# EAGLE design gsm_based_message_display_on_lcd (EAGLE 6.1)
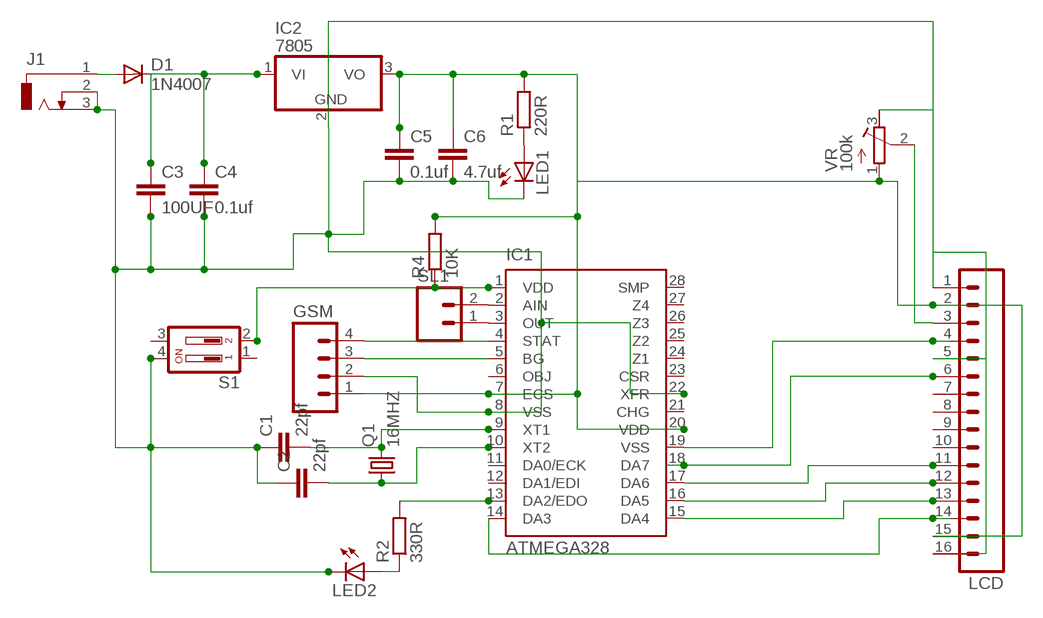
[diagram p0: schematic, sheet 1]

## Parts
C1  22pf  C2.5/2  [C2.5-2]
C2  22pf  C2.5/2  [C2.5-2]
C3  100UF  C2.5/2  [C2.5-2]
C4  0.1uf  C2.5/2  [C2.5-2]
C5  0.1uf  C2.5/2  [C2.5-2]
C6  4.7uf  C2.5/2  [C2.5-2]
D1  1N4007  1N4004  [DO41-10]
GSM  M04  [04P]
IC1  ATMEGA328  QT9701BD  [DIL28-3]
IC2  7805  786TV  [TO220V]
J1  DCJ0303  [DCJ0303]
LCD  M16  [16P]
LED1  LED3MM  [LED3MM]
LED2  LED3MM  [LED3MM]
Q1  16MHZ  CRYSTALHC49S  [HC49/S]
R1  220R  R-EU_0207/10  [0207/10]
R2  330R  R-EU_0207/10  [0207/10]
R4  10K  R-EU_0207/10  [0207/10]
S1  DP02  [DP-02]
SL1  M02  [02P]
VR  100k  R-TRIMM64P  [RTRIM64P]

## Nets
N$1: C1.2 IC1.9(XT1) Q1.2
N$2: C2.2 IC1.10(XT2) Q1.1
N$3: D1.A J1.1
N$4: C5.1 C6.1 GSM.1 IC1.7(ECS) IC1.20(VDD) IC2.3(VO) LCD.2 LCD.15 R1.2 R4.2 VR.1(E)
N$5: C1.1 C2.1 C3.2 C4.2 C5.2 C6.2 GSM.2 IC1.8(VSS) IC1.22(XFR) IC2.2(GND) J1.2 J1.3 LCD.1 LCD.5 LCD.16 LED1.K(C) LED2.K(C) S1.4 VR.3(A)
N$6: LED1.A R1.1
N$7: C3.1 C4.1 D1.C IC2.1(VI)
N$8: GSM.4 IC1.4(STAT)
N$9: GSM.3 IC1.5(BG)
N$10: IC1.3(OUT) SL1.1
N$11: IC1.2(AIN) SL1.2
N$21: IC1.13(DA2/EDO) R2.2
N$22: LCD.3 VR.2(S)
N$23: IC1.19(VSS) LCD.4
N$24: IC1.18(DA7) LCD.6
N$25: IC1.17(DA6) LCD.11
N$26: IC1.16(DA5) LCD.12
N$27: IC1.15(DA4) LCD.13
N$29: IC1.14(DA3) LCD.14
N$31: IC1.1(VDD) R4.1 S1.2
N$32: LED2.A R2.1
Unconnected: IC1.6(OBJ) IC1.11(DA0/ECK) IC1.12(DA1/EDI) IC1.21(CHG) IC1.23(CSR) IC1.24(Z1) IC1.25(Z2) IC1.26(Z3) IC1.27(Z4) IC1.28(SMP) LCD.7 LCD.8 LCD.9 LCD.10 S1.1 S1.3

## Library data of the parts
C1-C6 = capacitor-wima:C: CAPACITOR naming: grid - package width
D1 = diode:1N4004: DIODE general purpose rectifier, 1 A
GSM = con-amp-quick:M04: AMP QUICK CONNECTOR; OC_FARNELL: unknown; OC_NEWARK: unknown
IC1 = quantum-research-group:QT9701B: Charge-Transfer Capacitance Sensor IC Source: http://data.qprox.com/downloads/datasheets/qt9701b.pdf; OC_FARNELL: unknown; OC_NEWARK: unknown
IC2 = linear:78*: Positive VOLTAGE REGULATOR Source: http://cache.national.com/ds/LM/LM78L05.pdf http://www.fairchildsemi.com/ds/LM/LM7805.pdf
J1 = con-jack:DCJ0303: DC POWER JACK Source: DCJ0303.pdf; OC_FARNELL: unknown; OC_NEWARK: unknown
LCD = con-amp-quick:M16: AMP QUICK CONNECTOR; OC_FARNELL: unknown; OC_NEWARK: unknown
LED1 LED2 = led:LED: LED OSRAM: - CHIPLED LG R971, LG N971, LY N971, LG Q971, LY Q971, LO R971, LY R971 LH N974, LH R974 LS Q976, LO Q976, LY Q976 LO Q996 - Hyper CHIPLED LW Q18S LB Q993, LB Q99A, LB R99A - SideLED LS A670, LO A670, LY A670, LG A670, LP A670 LB A673, LV A673, LT A673, LW A673 LH A674 LY A675 LS A676, LA A676, LO A676, LY A676, LW A676 LS A679, LY A679, LG A679 - Hyper Micro SIDELED® LS Y876, LA Y876, LO Y876, LY Y876 LT Y87S - SmartLED LW L88C, LW L88S LB L89C, LB L89S, LG L890 LS L89K, LO L89K, LY L89K LS L896, LA L896, LO L896, LY L896 - TOPLED LS T670, LO T670, LY T670, LG T670, LP T670 LSG T670, LSP T670, LSY T670, LOP T670, LYG T670 LG T671, LOG T671, LSG T671 LB T673, LV T673, LT T673, LW T673 LH T674 LS T676, LA T676, LO T676, LY T676, LB T676, LH T676, LSB T676, LW T676 LB T67C, LV T67C, LT T67C, LS T67K, LO T67K, LY T67K, LW E67C LS E67B, LA E67B, LO E67B, LY E67B, LB E67C, LV E67C, LT E67C LW T67C LS T679, LY T679, LG T679 LS T770, LO T770, LY T770, LG T770, LP T770 LB T773, LV T773, LT T773, LW T773 LH T774 LS E675, LA E675, LY E675, LS T675 LS T776, LA T776, LO T776, LY T776, LB T776 LHGB T686 LT T68C, LB T68C - Hyper Mini TOPLED® LB M676 - Mini TOPLED Santana® LG M470 LS M47K, LO M47K, LY M47K Source: http://www.osram.convergy.de LUXEON: - LUMILED® LXK2-PW12-R00, LXK2-PW12-S00, LXK2-PW14-U00, LXK2-PW14-V00 LXK2-PM12-R00, LXK2-PM12-S00, LXK2-PM14-U00 LXK2-PE12-Q00, LXK2-PE12-R00, LXK2-PE12-S00, LXK2-PE14-T00, LXK2-PE14-U00 LXK2-PB12-K00, LXK2-PB12-L00, LXK2-PB12-M00, LXK2-PB14-N00, LXK2-PB14-P00, LXK2-PB14-Q00 LXK2-PR12-L00, LXK2-PR12-M00, LXK2-PR14-Q00, LXK2-PR14-R00 LXK2-PD12-Q00, LXK2-PD12-R00, LXK2-PD12-S00 LXK2-PH12-R00, LXK2-PH12-S00 LXK2-PL12-P00, LXK2-PL12-Q00, LXK2-PL12-R00 Source: www.luxeon.com KINGBRIGHT: KA-3528ASYC Source: www.kingbright.com
Q1 = crystal:CRYSTAL: CRYSTAL; OC_FARNELL: 1667008; OC_NEWARK: unknown
R1 R2 R4 = rcl:R-EU_: RESISTOR, European symbol
S1 = switch-dil:DP02: DIL/CODE SWITCH; MPN: MCDP02; OC_FARNELL: 1255233; OC_NEWARK: 26M1095
SL1 = con-amp-quick:M02: AMP QUICK CONNECTOR; OC_FARNELL: unknown; OC_NEWARK: unknown
VR = resistor:R-TRIMM: Trimm resistor

## Board
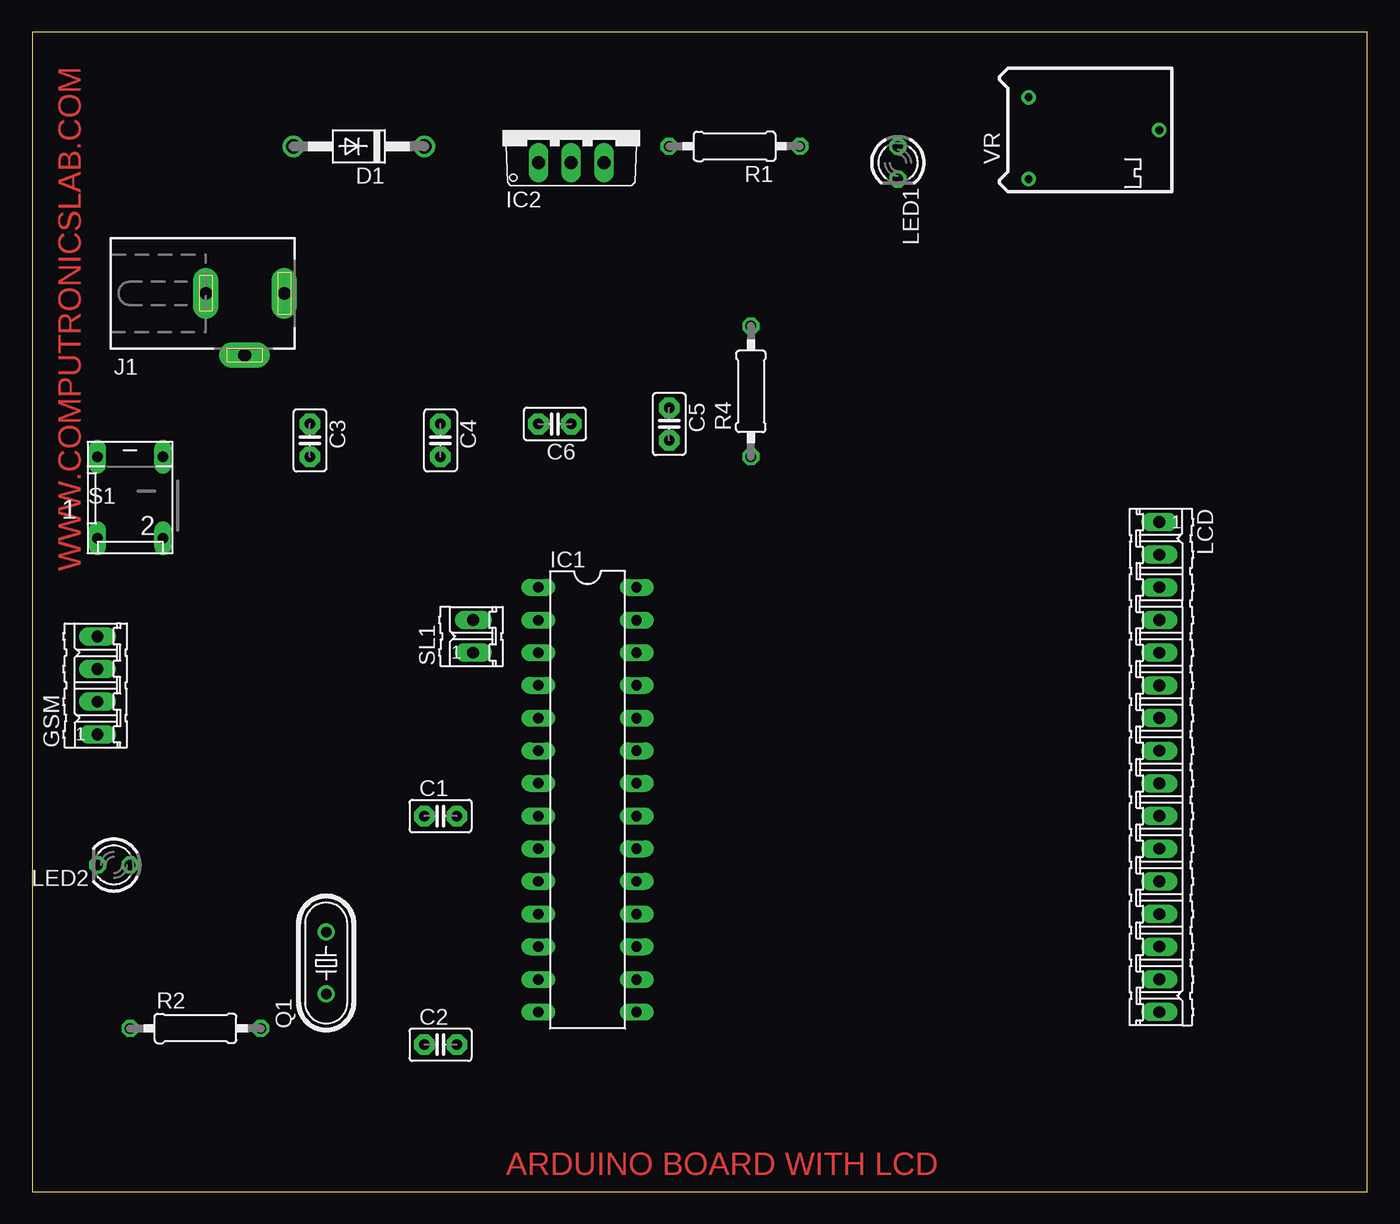
[diagram p1: board, top side]
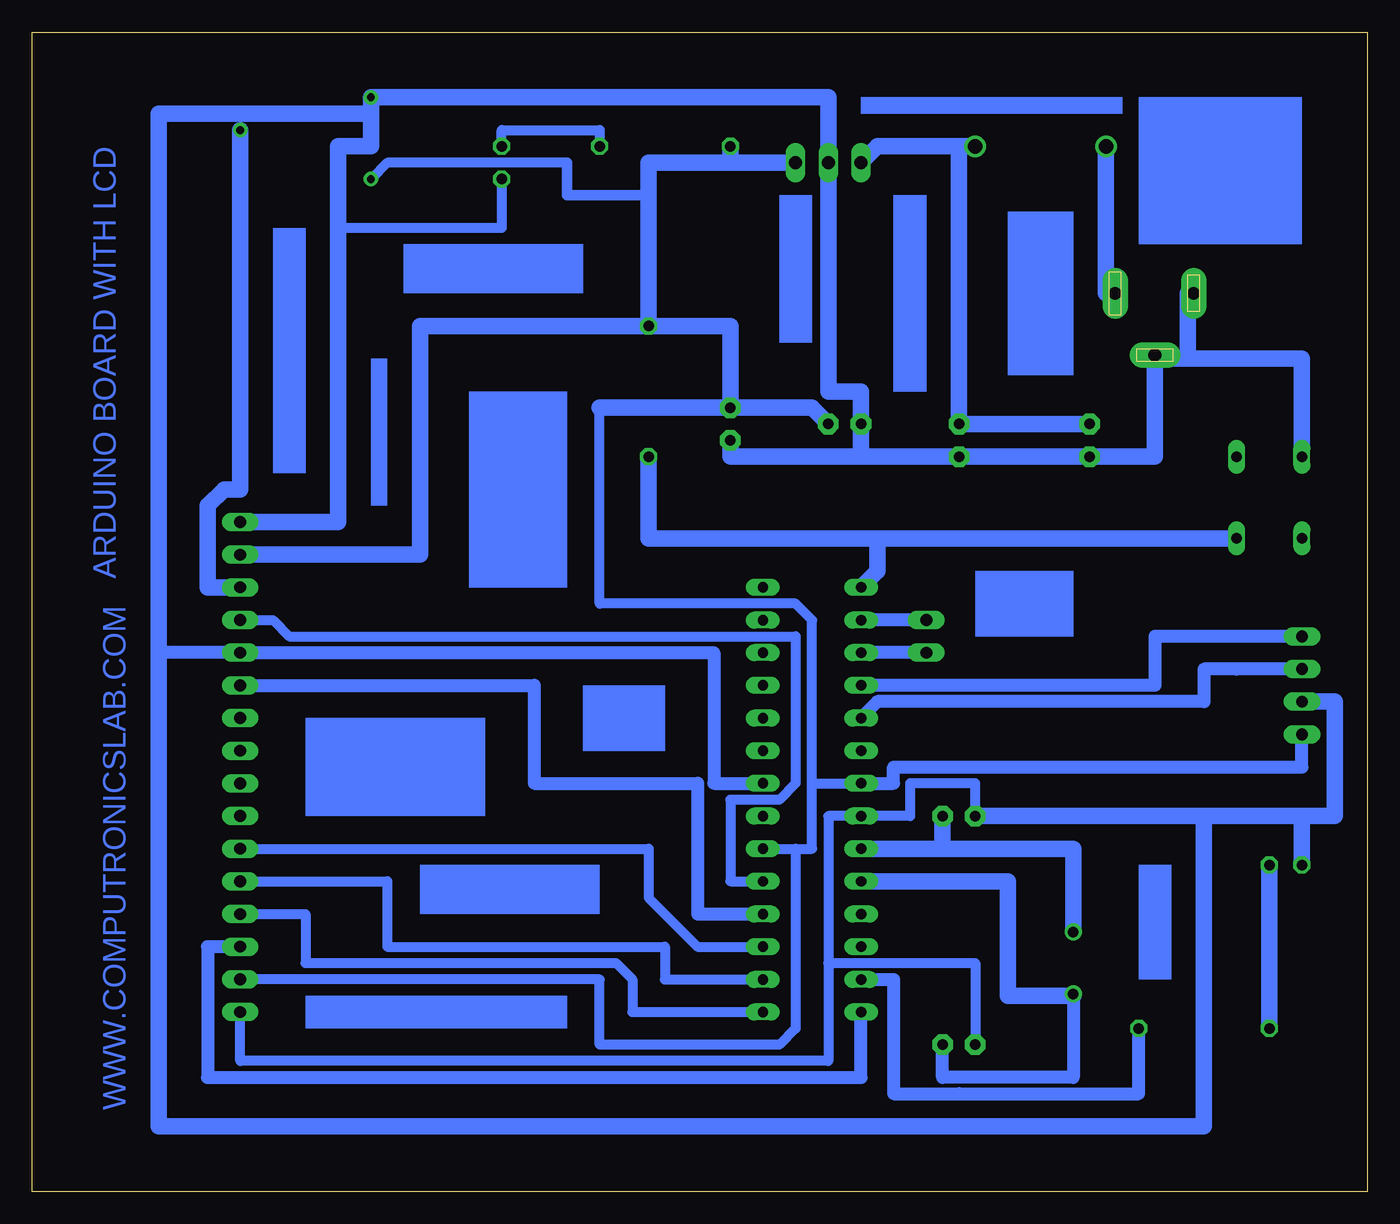
[diagram p2: board, bottom side, seen from below]

Size 103.81 x 90.16 mm. Coordinates in mm from the lower left corner, seen from the top.
Outline: 0,0 103.81,0 103.81,90.16 0,90.16 0,0
Copper layers (1*16): Top 0.035mm / dielectric 1.5mm / Bottom 0.035mm
Design rules: minimum track width 30mil, minimum drill 24mil, track to track 8mil, track to pad 8mil, pad to pad 8mil, via to via 8mil, smd to smd 8mil, copper to edge 40mil, drill to drill 8mil, minimum pad ring 10mil, minimum via ring 8mil, stop-mask expansion 4mil, vias tented up to drill 0mil, thermal gap 10mil

### Footprints (pad centres in the part's own frame; a part is rotated, then mirrored left to right if it is on the bottom)
C2.5-2 = drill 0.813 pad 1.6 octagon: 1 -1.27,0; 2 1.27,0
DO41-10 = drill 1.118: A 5.08,0; C -5.08,0
04P = drill 0.914 long: 1 -3.81,0; 2 -1.27,0; 3 1.27,0; 4 3.81,0
DIL28-3 = drill 0.813 long: 1 -16.51,-3.81; 2 -13.97,-3.81; 3 -11.43,-3.81; 4 -8.89,-3.81; 5 -6.35,-3.81; 6 -3.81,-3.81; 7 -1.27,-3.81; 8 1.27,-3.81; 9 3.81,-3.81; 10 6.35,-3.81; 11 8.89,-3.81; 12 11.43,-3.81; 13 13.97,-3.81; 14 16.51,-3.81; 15 16.51,3.81; 16 13.97,3.81; 17 11.43,3.81; 18 8.89,3.81; 19 6.35,3.81; 20 3.81,3.81; 21 1.27,3.81; 22 -1.27,3.81; 23 -3.81,3.81; 24 -6.35,3.81; 25 -8.89,3.81; 26 -11.43,3.81; 27 -13.97,3.81; 28 -16.51,3.81
TO220V = drill 1.016 long: 1 -2.54,-2.54; 2 0,-2.54; 3 2.54,-2.54
DCJ0303 = drill 1 pad 2 long: 1 0,3.1; 2 4.8,0; 3 0,-3
16P = drill 0.914 long: 1 -19.05,0; 2 -16.51,0; 3 -13.97,0; 4 -11.43,0; 5 -8.89,0; 6 -6.35,0; 7 -3.81,0; 8 -1.27,0; 9 1.27,0; 10 3.81,0; 11 6.35,0; 12 8.89,0; 13 11.43,0; 14 13.97,0; 15 16.51,0; 16 19.05,0
LED3MM = drill 0.813 octagon: A -1.27,0; K 1.27,0
HC49/S = drill 0.813: 1 -2.413,0; 2 2.413,0
0207/10 = drill 0.813 octagon: 1 -5.08,0; 2 5.08,0
DP-02 = drill 0.813 long: 1 -2.54,-2.54; 2 2.54,-2.54; 3 2.54,3.81; 4 -2.54,3.81
02P = drill 0.914 long: 1 -1.27,0; 2 1.27,0
RTRIM64P = drill 0.61: 1 -2.54,-3.81; 2 7.62,0; 3 -2.54,2.54

### Placement (x,y rotation side)
C1  31.75,29.21 0 top
C2  31.75,11.43 0 top
C3  21.59,58.42 270 top
C4  31.75,58.42 270 top
C5  49.53,59.69 270 top
C6  40.64,59.69 180 top
D1  25.4,81.28 180 top
GSM  5.08,39.37 90 top
IC1  43.18,30.48 270 top
IC2  41.91,82.55 0 top
J1  16.51,69.85 270 top
LCD  87.63,33.02 270 top
LED1  67.31,80.01 270 top
LED2  6.35,25.4 180 top
Q1  22.86,17.78 90 top
R1  54.61,81.28 180 top
R2  12.7,12.7 0 top
R4  55.88,62.23 90 top
S1  7.62,53.34 0 top
SL1  34.29,43.18 90 top
VR  80.01,82.55 0 top

### Tracks (layer width: path | path; a pad name or v marks a point on that pad's centre or on a via)
N$1
  Bottom 0.762: 22.86,20.32 Q1.2
  Bottom 1.27: 22.86,20.32 22.86,26.67 29.21,26.67 33.02,26.67 | IC1.9 33.02,26.67 | 33.02,26.67 C1.2
N$2
  Bottom 0.762: 22.86,15.24 Q1.1
  Bottom 1.016: C2.2 33.02,8.89 22.86,8.89 22.86,15.24
  Bottom 1.27: 22.86,15.24 27.94,15.24 27.94,24.13 IC1.10
N$3
  Bottom 1.27: D1.A 20.32,69.85 J1.1
N$4
  Bottom 0.762: VR.1 76.2,80.01 62.23,80.01 | 43.18,31.75 IC1.7 | IC1.20 44.45,26.67 | 44.45,26.67 43.18,26.67 43.18,31.75 | LCD.15 59.69,16.51 59.69,11.43 45.72,11.43 44.45,12.7 44.45,26.67 | 59.69,60.96 59.69,45.72 44.45,45.72 43.18,44.45 43.18,31.75
  Bottom 0.813: 55.88,77.47 62.23,77.47 62.23,80.01
  Bottom 1.016: GSM.1 5.08,33.02 36.83,33.02 36.83,31.75 IC1.7
  Bottom 1.27: IC2.3 49.53,80.01 | 49.53,80.01 55.88,80.01 55.88,77.47 R4.2 | 49.53,80.01 R1.2 | C5.1 49.53,67.31 R4.2 | LCD.2 73.66,49.53 73.66,67.31 R4.2 | C6.1 43.18,60.96 C5.1 | 59.69,60.96 C5.1
N$5
  Bottom 0.762: C1.1 30.48,31.75 35.56,31.75 35.56,29.21 IC1.8 41.91,29.21 41.91,17.78 | LCD.16 87.63,10.16 41.91,10.16 41.91,17.78 | C2.1 30.48,17.78 41.91,17.78 | 13.97,69.85 J1.3 | 77.47,83.82 VR.3 | 80.01,74.93 67.31,74.93 LED1.K
  Bottom 1.016: IC1.22 50.8,31.75 50.8,41.91 LCD.5 93.98,41.91
  Bottom 1.27: 5.08,29.21 LED2.K | C1.1 12.7,29.21 | 12.7,29.21 5.08,29.21 | GSM.2 2.54,38.1 2.54,29.21 5.08,29.21 | 13.97,64.77 5.08,64.77 S1.4 | 16.51,64.77 13.97,64.77 | 13.97,64.77 13.97,69.85 | C5.2 49.53,57.15 39.37,57.15 | 39.37,57.15 C4.2 C3.2 16.51,57.15 16.51,64.77 | 39.37,57.15 C6.2 39.37,62.23 41.91,62.23 IC2.2 41.91,85.09 VR.3 77.47,81.28 80.01,81.28 80.01,74.93 80.01,52.07 LCD.1 | 16.51,64.77 J1.2 | 77.47,83.82 93.98,83.82 93.98,41.91 93.98,5.08 12.7,5.08 12.7,29.21
N$6
  Bottom 0.762: LED1.A 67.31,82.55 59.69,82.55 R1.1
N$7
  Bottom 1.27: C3.1 C4.1 31.75,81.28 | IC2.1 38.1,81.28 31.75,81.28 | D1.C 31.75,81.28
N$8
  Bottom 1.016: IC1.4 16.51,39.37 16.51,41.91 16.51,43.18 12.7,43.18 GSM.4
N$9
  Bottom 1.016: IC1.5 38.1,38.1 12.7,38.1 12.7,39.37 12.7,40.64 10.16,40.64 GSM.3
N$10
  Bottom 1.016: SL1.1 IC1.3
N$11
  Bottom 1.016: SL1.2 IC1.2
N$21
  Bottom 1.016: R2.2 17.78,7.62 31.75,7.62 36.83,7.62 36.83,12.7 36.83,16.51 IC1.13
N$22
  Bottom 1.27: VR.2 87.63,54.61 88.9,54.61 90.17,53.34 90.17,46.99 LCD.3
N$23
  Bottom 0.762: IC1.19 49.53,24.13 49.53,30.48 45.72,30.48 44.45,31.75 44.45,43.18 83.82,43.18 85.09,44.45 LCD.4
N$24
  Bottom 1.016: IC1.18 52.07,21.59 52.07,31.75 64.77,31.75 64.77,33.02 64.77,39.37 LCD.6
N$25
  Bottom 0.762: IC1.17 52.07,19.05 55.88,22.86 55.88,24.13 55.88,26.67 LCD.11
N$26
  Bottom 0.762: IC1.16 54.61,16.51 54.61,19.05 76.2,19.05 76.2,24.13 LCD.12
N$27
  Bottom 0.762: IC1.15 57.15,13.97 57.15,16.51 58.42,17.78 82.55,17.78 82.55,21.59 LCD.13
N$29
  Bottom 1.016: IC1.14 39.37,8.89 90.17,8.89 90.17,19.05 LCD.14
N$31
  Bottom 0.762: 38.1,50.8 38.1,48.26
  Bottom 1.27: 38.1,50.8 35.56,50.8 S1.2 | IC1.1 38.1,48.26 38.1,50.8 | 38.1,50.8 55.88,50.8 R4.1
N$32
  Bottom 1.27: LED2.A R2.1
(copper drawn outside any net)
  shapes: Bottom area x15

### Text on the board
Top: WWW.COMPUTRONICSLAB.COM | ARDUINO BOARD WITH LCD
Bottom: ARDUINO BOARD WITH LCD | WWW.COMPUTRONICSLAB.COM